# Altium project NEW_DC_motor_driver.PrjPcb
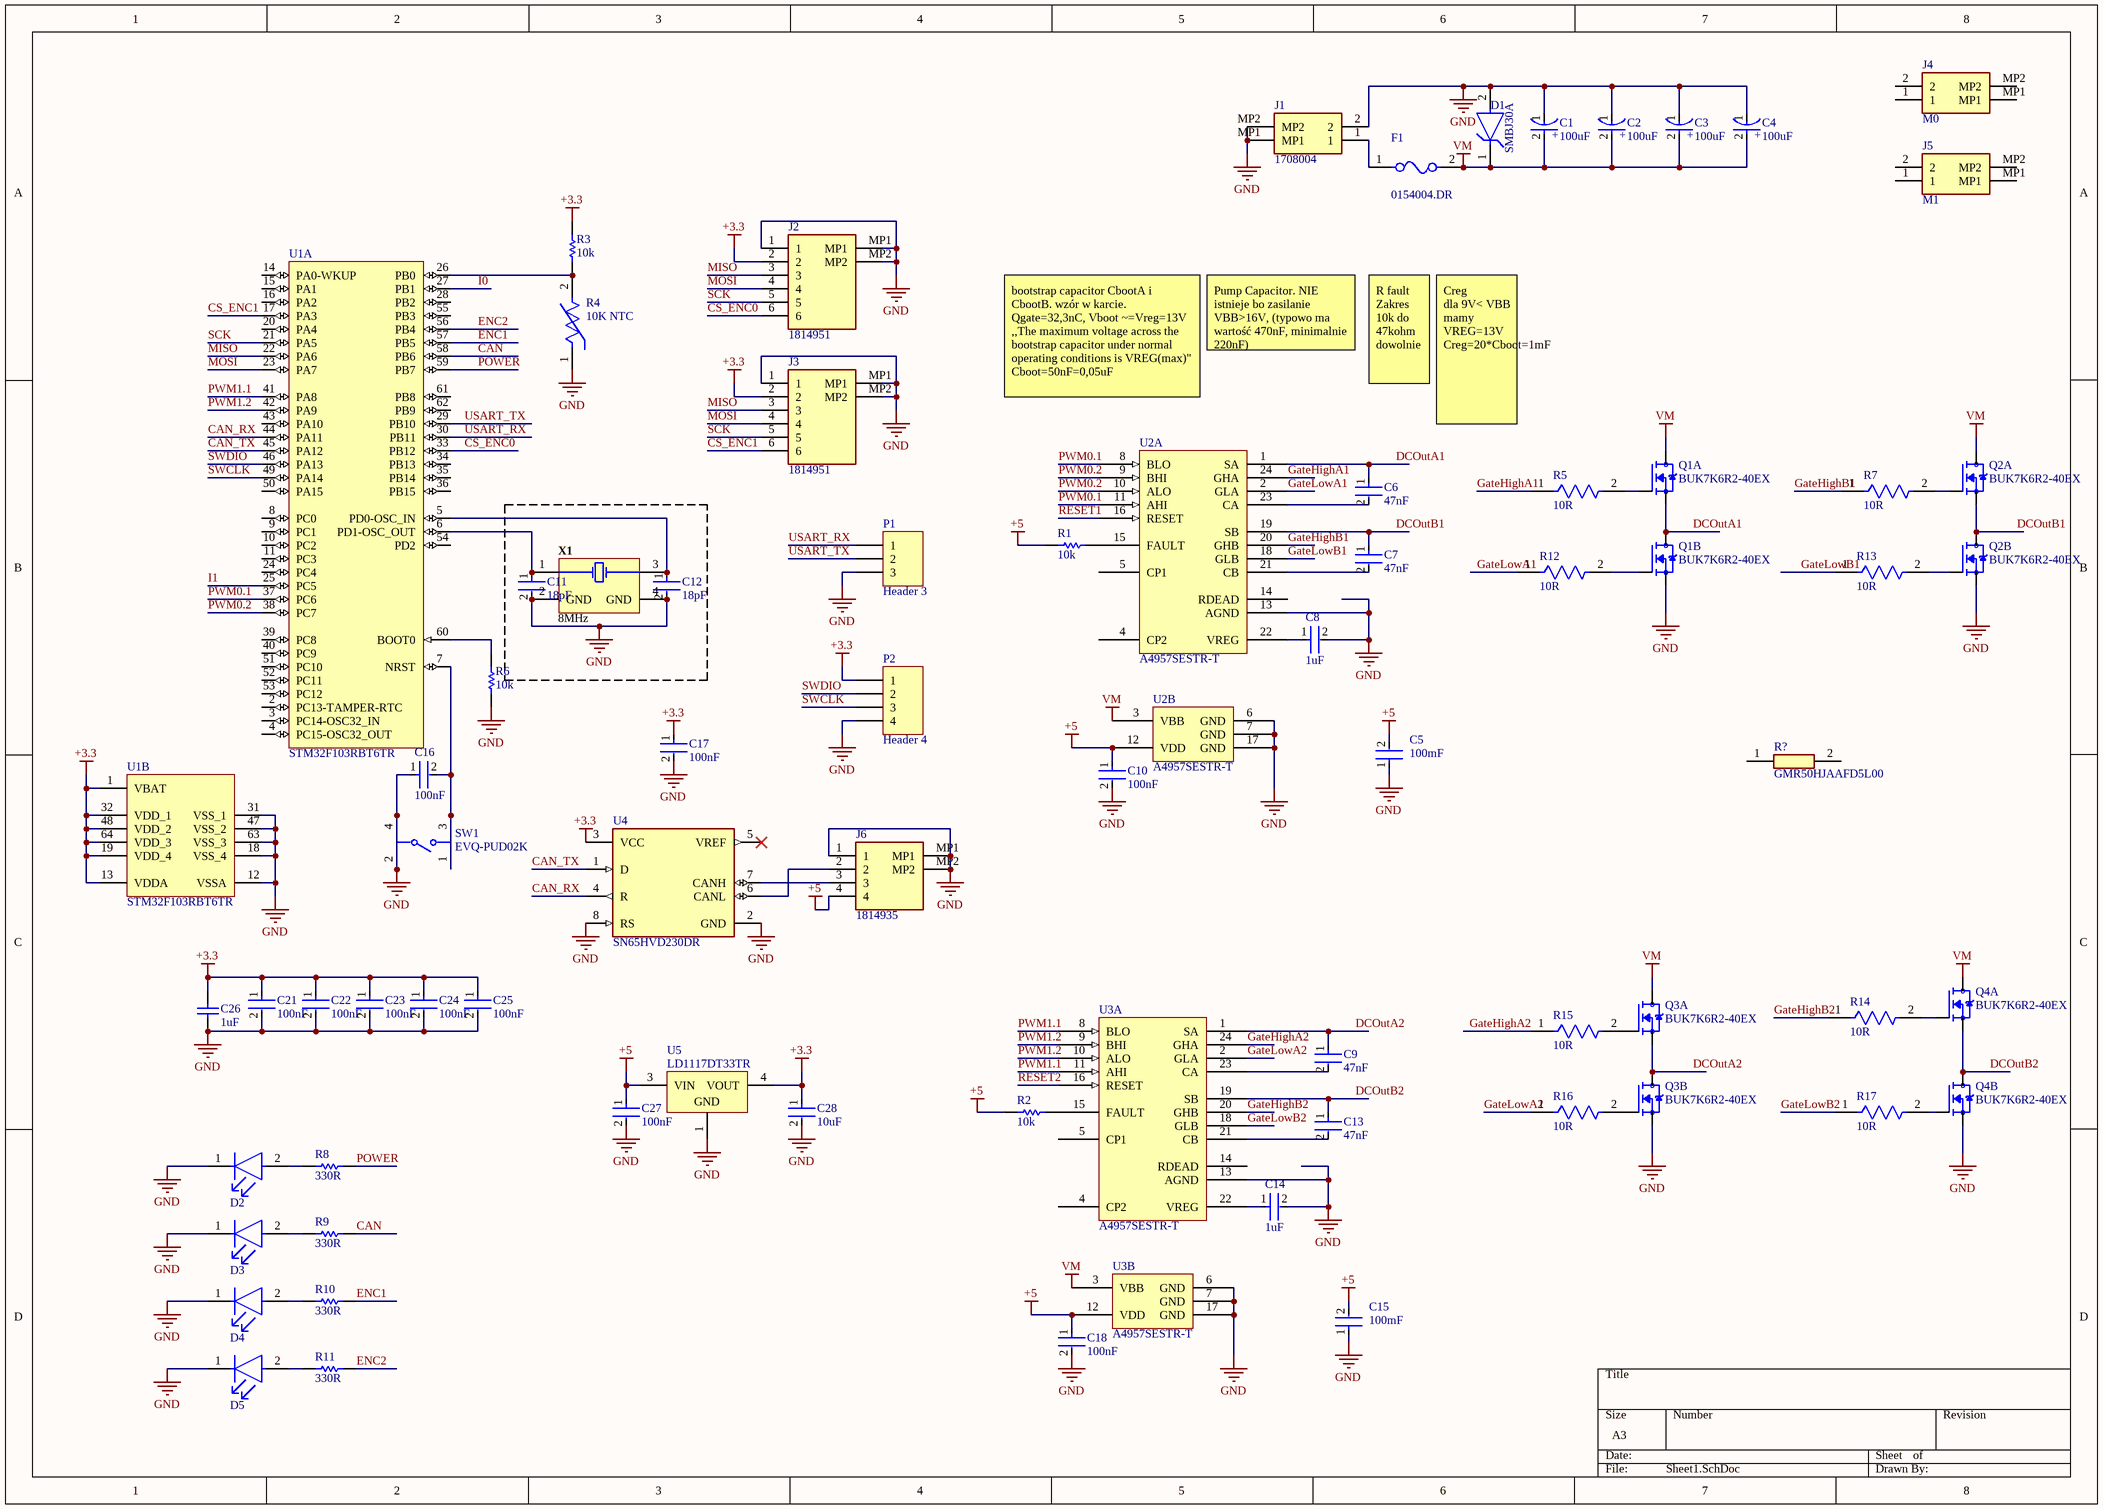
[diagram p0: Sheet1.SchDoc]
1 sheet, 69 parts. Net scope: global (net labels, ports and power ports of the same name join across sheets).
Board file: PCB1.PcbDoc

## Sheet Sheet1.SchDoc
size A3; Author: MG; CompanyName: SKAR; DrawnBy: MG; Revision: 1; SheetNumber: 1; SheetTotal: 1

### Parts
C1  100uF  [FP-FTD-MFG]
C2  100uF  [FP-FTD-MFG]
C3  100uF  [FP-FTD-MFG]
C4  100uF  [FP-FTD-MFG]
C5  100mF  [FP-0805-L_2_01_0_2-W_1_25-IPC_B]
C6  47nF  [FP-0805-L_2_01_0_2-W_1_25-IPC_B]
C7  47nF  [FP-0805-L_2_01_0_2-W_1_25-IPC_B]
C8  1uF  [FP-0805-L_2_01_0_2-W_1_25-MFG]
C9  47nF  [FP-0805-L_2_01_0_2-W_1_25-IPC_B]
C10  100nF  [FP-0805-L_2_01_0_2-W_1_25-IPC_B]
C11  18pF  [FP-C0603C-CF-MFG]
C12  18pF  [FP-C0603C-CF-MFG]
C13  47nF  [FP-0805-L_2_01_0_2-W_1_25-IPC_B]
C14  1uF  [FP-0805-L_2_01_0_2-W_1_25-MFG]
C15  100mF  [FP-0805-L_2_01_0_2-W_1_25-IPC_B]
C16  100nF  [FP-0805-L_2_01_0_2-W_1_25-IPC_B]
C17  100nF  [FP-0805-L_2_01_0_2-W_1_25-MFG]
C18  100nF  [FP-0805-L_2_01_0_2-W_1_25-IPC_B]
C21  100nF  [FP-0805-L_2_01_0_2-W_1_25-IPC_B]
C22  100nF  [FP-0805-L_2_01_0_2-W_1_25-IPC_B]
C23  100nF  [FP-0805-L_2_01_0_2-W_1_25-IPC_B]
C24  100nF  [FP-0805-L_2_01_0_2-W_1_25-IPC_B]
C25  100nF  [FP-0805-L_2_01_0_2-W_1_25-IPC_B]
C26  1uF  [CAPC2013X145X50ML20T25]
C27  100nF  [FP-0805-L_2_01_0_2-W_1_25-IPC_B]
C28  10uF  [FP-C0805C-DG-IPC_B]
D1  SMBJ30A  [FP-SMBJ30A-E3-52-0]
D2  TLLG4401  [FP-6_544-5255_01-4-MFG]  (value not drawn)
D3  TLLG4401  [FP-6_544-5255_01-4-MFG]  (value not drawn)
D4  TLLG4401  [FP-6_544-5255_01-4-MFG]  (value not drawn)
D5  TLLG4401  [FP-6_544-5255_01-4-MFG]  (value not drawn)
F1  0154004.DR  [FP-0154-MFG]
J1  1708004  [1708004]
J2  1814951  [1814951]
J3  1814951  [1814951]
J4  M0  [1815125]
J5  M1  [1815125]
J6  1814935  [1814935]
P1  Header 3  [HDR1X3]
P2  Header 4  [HDR1X4]
Q1  BUK7K6R2-40EX  [TRANS_BUK7K6R2-40EX]  (parts A,B of 2)
Q2  BUK7K6R2-40EX  [TRANS_BUK7K6R2-40EX]  (parts A,B of 2)
Q3  BUK7K6R2-40EX  [TRANS_BUK7K6R2-40EX]  (parts A,B of 2)
Q4  BUK7K6R2-40EX  [TRANS_BUK7K6R2-40EX]  (parts A,B of 2)
R1  10k  [RESC2013X60X35NL10T20]
R2  10k  [RESC2013X60X35NL10T20]
R3  10k  [RESC2013X60X35ML10T20]
R4  10K NTC  [FP-NCP18-0_15-IPC_A]
R5  10R  [FP-RR1220-IPC_A]
R6  10k  [RESC2013X60X35ML10T20]
R7  10R  [FP-RR1220-IPC_A]
R8  330R  [RESC2013X60X35ML10T20]
R9  330R  [RESC2013X60X35ML10T20]
R10  330R  [RESC2013X60X35ML10T20]
R11  330R  [RESC2013X60X35ML10T20]
R12  10R  [FP-RR1220-IPC_A]
R13  10R  [FP-RR1220-IPC_A]
R14  10R  [FP-RR1220-IPC_A]
R15  10R  [FP-RR1220-IPC_A]
R16  10R  [FP-RR1220-IPC_A]
R17  10R  [FP-RR1220-IPC_A]
R?  GMR50HJAAFD5L00  [GMR50HJAAFD5L00]
SW1  EVQ-PUD02K  [FP-EVQ-PUD02K-MFG]
U1  STM32F103RBT6TR  [STM-LQFP64_V]  (parts A,B of 2)
U2  A4957SESTR-T  [QFN50P400X400X80_HS-25M(A4957SESTR-T)]  (parts A,B of 2)
U3  A4957SESTR-T  [QFN50P400X400X80_HS-25M(A4957SESTR-T)]  (parts A,B of 2)
U4  SN65HVD230DR  [FP-D0008A-IPC_A]
U5  LD1117DT33TR  [TO-252_M]
X1  8MHz  [TXC-7B-4_V]

### Nets
+3.3: C17.1 C21.1 C22.1 C23.1 C24.1 C25.1 C26.2 C28.1 J2.2 J3.2 P2.1 R3.2 U1.1(VBAT) U1.13(VDDA) U1.19(VDD_4) U1.32(VDD_1) U1.48(VDD_2) U1.64(VDD_3) U4.3(VCC) U5.4(VOUT)
+5: C5.2 C10.1 C15.2 C18.1 C27.1 J6.4 R1.1 R2.1 U2.12(VDD) U3.12(VDD) U5.3(VIN)
GND: C1.1(C) C2.1(C) C3.1(C) C4.1(C) C5.1 C8.2 C10.2 C11.2 C12.2 C14.2 C15.1 C16.1 C17.2 C18.2 C21.2 C22.2 C23.2 C24.2 C25.2 C26.1 C27.2 C28.2 D1.2(A) D2.1(C) D3.1(C) D4.1(C) D5.1(C) J1.2 J1.MP1 J1.MP2 J2.1 J2.MP1 J2.MP2 J3.1 J3.MP1 J3.MP2 J6.1 J6.MP1 J6.MP2 P1.3 P2.4 Q1.3(S2) Q2.3(S2) Q3.3(S2) Q4.3(S2) R4.1 R6.1 SW1.2 SW1.4 U1.12(VSSA) U1.18(VSS_4) U1.31(VSS_1) U1.47(VSS_2) U1.63(VSS_3) U2.6(GND) U2.7(GND) U2.13(AGND) U2.17(GND) U3.6(GND) U3.7(GND) U3.13(AGND) U3.17(GND) U4.2(GND) U4.8(RS) U5.1(GND) X1.2(GND) X1.4(GND)
VM: C1.2(A) C2.2(A) C3.2(A) C4.2(A) D1.1(C) F1.2 Q1.7_8(D1) Q2.7_8(D1) Q3.7_8(D1) Q4.7_8(D1) U2.3(VBB) U3.3(VBB)
CAN: R9.1 U1.58(PB6)
CAN_RX: U1.44(PA11) U4.4(R)
CAN_TX: U1.45(PA12) U4.1(D)
CS_ENC0: J2.6 U1.33(PB12)
CS_ENC1: J3.6 U1.17(PA3)
DCOutA1: C6.1 Q1.1(S1) Q1.5_6(D2) U2.1(SA)
DCOutA2: C9.1 Q3.1(S1) Q3.5_6(D2) U3.1(SA)
DCOutB1: C7.1 Q2.1(S1) Q2.5_6(D2) U2.19(SB)
DCOutB2: C13.1 Q4.1(S1) Q4.5_6(D2) U3.19(SB)
ENC1: R10.1 U1.57(PB5)
ENC2: R11.1 U1.56(PB4)
GateHighA1: R5.1 U2.24(GHA)
GateHighA2: R15.1 U3.24(GHA)
GateHighB1: R7.1 U2.20(GHB)
GateHighB2: R14.1 U3.20(GHB)
GateLowA1: R12.1 U2.2(GLA)
GateLowA2: R16.1 U3.2(GLA)
GateLowB1: R13.1 U2.18(GLB)
GateLowB2: R17.1 U3.18(GLB)
I0: U1.27(PB1)
I1: U1.25(PC5)
MISO: J2.3 J3.3 U1.22(PA6)
MOSI: J2.4 J3.4 U1.23(PA7)
POWER: R8.1 U1.59(PB7)
PWM0.1: U1.37(PC6) U2.8(BLO) U2.11(AHI)
PWM0.2: U1.38(PC7) U2.9(BHI) U2.10(ALO)
PWM1.1: U1.41(PA8) U3.8(BLO) U3.11(AHI)
PWM1.2: U1.42(PA9) U3.9(BHI) U3.10(ALO)
RESET1: U2.16(RESET)
RESET2: U3.16(RESET)
SCK: J2.5 J3.5 U1.21(PA5)
SWCLK: P2.3 U1.49(PA14)
SWDIO: P2.2 U1.46(PA13)
USART_RX: P1.1 U1.30(PB11)
USART_TX: P1.2 U1.29(PB10)
NetC6_2: C6.2 U2.23(CA)
NetC7_2: C7.2 U2.21(CB)
NetC8_1: C8.1 U2.22(VREG)
NetC9_2: C9.2 U3.23(CA)
NetC11_1: C11.1 U1.6(PD1-OSC_OUT) X1.1(X1)
NetC12_1: C12.1 U1.5(PD0-OSC_IN) X1.3(X2)
NetC13_2: C13.2 U3.21(CB)
NetC14_1: C14.1 U3.22(VREG)
NetC16_2: C16.2 SW1.1 SW1.3 U1.7(NRST)
NetD2_2: D2.2(A) R8.2
NetD3_2: D3.2(A) R9.2
NetD4_2: D4.2(A) R10.2
NetD5_2: D5.2(A) R11.2
NetF1_1: F1.1 J1.1
NetJ6_2: J6.2 U4.6(CANL)
NetJ6_3: J6.3 U4.7(CANH)
NetQ1_2: Q1.2(G1) R5.2
NetQ1_4: Q1.4(G2) R12.2
NetQ2_2: Q2.2(G1) R7.2
NetQ2_4: Q2.4(G2) R13.2
NetQ3_2: Q3.2(G1) R15.2
NetQ3_4: Q3.4(G2) R16.2
NetQ4_2: Q4.2(G1) R14.2
NetQ4_4: Q4.4(G2) R17.2
NetR1_2: R1.2 U2.15(FAULT)
NetR2_2: R2.2 U3.15(FAULT)
NetR3_1: R3.1 R4.2 U1.26(PB0)
NetR6_2: R6.2 U1.60(BOOT0)

Not connected (* = marked no-connect by the designer): J4 1 2 MP1 MP2; J5 1 2 MP1 MP2; R? 1 2; U1 2(PC13-TAMPER-RTC) 3(PC14-OSC32_IN) 4(PC15-OSC32_OUT) 8(PC0) 9(PC1) 10(PC2) 11(PC3) 14(PA0-WKUP) 15(PA1) 16(PA2) 20(PA4) 24(PC4) 28(PB2) 34(PB13) 35(PB14) 36(PB15) 39(PC8) 40(PC9) 43(PA10) 50(PA15) 51(PC10) 52(PC11) 53(PC12) 54(PD2) 55(PB3) 61(PB8) 62(PB9); U2 4(CP2) 5(CP1) 14(RDEAD); U3 4(CP2) 5(CP1) 14(RDEAD); U4 5(VREF)*

### Notes on the sheet
- Pump Capacitor. NIE istnieje bo zasilanie VBB>16V, (typowo ma wartość 470nF, minimalnie 220nF)
- R fault                                                                                    Zakres 10k do 47kohm dowolnie
- bootstrap capacitor CbootA i CbootB. wzór w karcie. Qgate=32,3nC, Vboot ~=Vreg=13V             ,,The maximum voltage across the bootstrap capacitor under normal operating conditions is VREG(max)"                            Cboot=50nF=0,05uF
- Creg
  dla 9V< VBB mamy VREG=13V Creg=20*Cboot=1mF
- (in symbol CMP-05427-000027-1) +

### Library data of the parts
C1-C4 = CMP-05427-000027-1: CAP ALUM 100UF 20% 35V SMD; Ripple Current: 300mA; Polarity: Polar; Life (Hours): 2000Hour; Lead Diameter: 0.65mm; ESR (Equivalent Series Resistance): 260mR; Leakage Current: 35uA; REACH SVHC: No SVHC; Series: FT; Min Operating Temperature: -55°C; Diameter: 6.3mm; Max Operating Temperature: 105°C; Number of Pins: 2; Package Quantity: 1000; Length: 5.8mm; Lead Pitch: 1.8mm; Voltage: 35V; Construction: Cylindrical; Capacitance: 100uF; Height: 5.8mm; Tolerance: 20%; RoHS Compliant: Yes; Packaging: Tape and Reel; Ripple Current (AC): 300mA; Height - Seated (Max): 0.24inch; Voltage Rating: 35V; Radiation Hardening: No; Contact Plating: Tin; Termination: SMD/SMT; Voltage Rating (DC): 35V; Case/Package: Radial; Mount: Surface Mount
C5 C10 C15-C18 C21-C25 C27 = CMP-2007-04174-2: General Purpose Ceramic Capacitor, 0805, 100nF, 10%, X7R, 15%, 100V; Packaging: Tape and Reel; Min Operating Temperature: -55°C; Dielectric Material: Ceramic; Height: 1.4mm; Voltage Rating: 100V; Termination: SMD/SMT; Case Code (Imperial): 0805; Case Code (Metric): 2012; Case/Package: 0805; Construction: Flat; Radiation Hardening: No; Series: -; Dielectric: X7R; Package Quantity: 2000; Mount: Surface Mount; Capacitance: 100nF; Contact Plating: Tin; Voltage: 100V; Lead Free: Lead Free; Depth: 1.25mm; RoHS Compliant: Yes; Number of Pins: 2; Max Operating Temperature: 125°C; Length: 2.01mm; Voltage Rating (DC): 100V; Thickness: 0.055inch; REACH SVHC: No SVHC; Width: 0.049inch; Tolerance: 10%
C6 C7 C9 C13 = CMP-2007-04794-2: General Purpose Ceramic Capacitor, 0805, 47nF, 10%, X8R, 15%, 50V; Packaging: Cut Tape; Case/Package: 0805; Length: 2.01mm; Voltage Rating (DC): 50V; Voltage: 50V; Voltage Rating: 50V; Case Code (Imperial): 0805; Case Code (Metric): 2012; Number of Pins: 2; Termination: SMD/SMT; Max Operating Temperature: 150°C; Capacitance: 47nF; Min Operating Temperature: -55°C; Dielectric Material: Ceramic; Series: Standard; Dielectric: X8R; REACH SVHC: No SVHC; Mount: Surface Mount; Depth: 1.25mm; RoHS Compliant: Yes; Height: 0.94mm; Tolerance: 10%
C8 C14 = CMP-2007-04692-2: General Purpose Ceramic Capacitor, 0805, 1uF, 10%, X7R, 15%, 25V; Max Operating Temperature: 125°C; Contact Plating: Tin; Tolerance: 10%; Dielectric: X7R; Case/Package: 0805; Package Quantity: 3000; Width: 0.049inch; Voltage Rating: 25V; Capacitance: 1uF; Lead Free: Lead Free; REACH SVHC: No SVHC; RoHS Compliant: Yes; Case Code (Imperial): 0805; Packaging: Tape and Reel; Dielectric Material: Ceramic; Series: -; Construction: Flat; Termination: SMD/SMT; Radiation Hardening: No; Voltage: 25V; Height: 1.4mm; Number of Pins: 2; Mount: Surface Mount; Length: 2.01mm; Depth: 1.25mm; Voltage Rating (DC): 25V; Min Operating Temperature: -55°C; Thickness: 0.037inch; Case Code (Metric): 2012
C11 C12 = CMP-2006-03103-2: CAP CER 18PF 100V 5% NP0 0603; Manufacturer: KEMET; Manufacturer Part Number: C0603C180J1GACTU; Automotive Grade: Grade 1; Temperature Characteristic: C0G; Material: Ceramic; Tolerance: 0.05; Temperature Coefficient: 30ppm/°C; Temperature Range High: +125°C; RoHS: TRUE; Lead Free: Yes; Device Class L1: Passive Components; Mouser Description: Multilayer Ceramic Capacitors MLCC - SMD/SMT 100volts 18pF C0G 5%; Automotive: Yes; Category: Cap; Temperature Range Low: -55°C; Package: C0603C-CF; Digikey Description: CAP CER 18PF 100V 5% NP0 0603; Voltage Rating: 100 V; Value: 18 pF; Device Class L3: Ceramic Capacitors; Temperature: -55°C to +125°C; Capacitance: 18 pF; Octopart: https://octopart.com/c0603c180j1gactu-kemet-9138579; Height: 0.87mm; ComponentLink2URL: https://api.kemet.com/component-edge/download/datasheet/C0603C100J5GACAUTO.pdf; ComponentLink2Description: Datasheet; Device Class L2: Capacitors
C26 = CMP-1036-04746-2: Manufacturer: Kemet; Part Number: C0805C105K4PACTU
C28 = CMP-2007-03243-2: CAP CER 10UF 10V X5R 0805; Manufacturer Part Number: C0805C106K8PACTU; Manufacturer: Kemet; 3DS Part Number: 220-00001; Tolerance: 10%; Temperature Coefficient: 15%; Material: Ceramic; Device Class L2: Capacitors; Device Class L1: Passive Components; ComponentLink2URL: https://content.kemet.com/datasheets/KEM_C1006_X5R_SMD.pdf; Height: 1.4mm; Lead Free: Yes; Digikey Description: CAP CER 10UF 10V X5R 0805; Octopart: https://octopart.com/c0805c106k8pactu-kemet-98697; Capacitance: 10uF; Value: 10uF; Temperature Range Low: -55°C; Temperature: -55°C to +85°C; Automotive: No; Mouser Description: CAP CER 10UF 10V X5R 0805; Ipc Land Pattern Name: CAPC200125X125; Temperature Range High: +85°C; Voltage: 10V; RoHS: TRUE; Device Class L3: Ceramic Capacitors; ComponentLink2Description: Datasheet; Voltage Rating: 10V; Package: C0805C-DG; Temperature Characteristic: X5R; Category: Cap
D1 = CMP-02577-000026-1: TVS DIODE 30VWM 48.4VC DO214AA; Polarity: Unidirectional; Clamping Voltage: 48.4V; Element Configuration: Single; Leakage Current: 1uA; Min Breakdown Voltage: 33.3V; Peak Pulse Power: 600W; Max Breakdown Voltage: 36.8V; Test Current: 1mA; Max Surge Current: 12.4A; Number of Unidirectional Channels: 1; Power Line Protection: No; Diode Type: ZENER; Operating Supply Voltage: 30V; Max Operating Temperature: 150°C; Number of Pins: 2; Series: TransZorb®; Min Operating Temperature: -55°C; Package Quantity: 750; Mount: Surface Mount; Resistor Type: Zener; Clamping Voltage-Max: 48.4V; Packaging: Tape and Reel; Length: 4.57mm; Direction: Unidirectional; Termination: SMD/SMT; Reverse Breakdown Voltage: 33.3V; Peak Pulse Current: 12.4A; Lead Free: Lead Free; Height: 2.24mm; RoHS Compliant: Yes; Breakdown Voltage: 36.8V; Max Power Dissipation: 600W; Power Dissipation: 600W; Max Reverse Leakage Current: 1uA; Reverse Standoff Voltage: 30V; Number of Channels: 1; Case/Package: DO-214AA; Width: 3.94mm; Number of Elements: 1; Radiation Hardening: No
D2-D5 = CMP-00030-39390728-1: TLLG4401 LED, Green, 2mcd, 3mmDia., T-1, +/-25deg, 565nm, 7mA, 1.9V Vf, 20V Vr, 20mW, -40; Test Current: 2mA; Wavelength: 575nm; Number of Elements: 1; Viewing Angle: 25°; Lens Transparency: Diffused; Voltage Rating (DC): 2.4V; Lead Length: 23mm; Max Junction Temperature (Tj): 100°C; Lens Style: Circular, Colored, Diffused, Dome, Round, Tinted; Reverse Voltage: 6V; Forward Voltage: 1.9V; Length: 3.2mm; Forward Current: 2mA; Color: Green; Dominant Wavelength: 575nm; Radiation Hardening: No; NexarPartId: 39390728; Lens Color: Green; REACH SVHC: Unknown; Lead Free: Lead Free; Number of Pins: 2; Luminous Intensity: 2mcd; Schedule B: 8541402000, 8541402000; Max Operating Temperature: 100°C; Illumination Color: Green; Mount: Through Hole; Packaging: Bulk; Depth: 3.2mm; Ambient Temperature Range High: 100°C; Case/Package: Radial; Power Dissipation: 20mW; Height: 4.5mm; RoHS: Compliant; Peak Wavelength: 565nm; Min Operating Temperature: -40°C; Number of LEDs: 1
F1 = CMP-08605-000003-1: FUSE BRD MNT 4A 125VAC/VDC 2SMD; Manufacturer: Littelfuse; Fuse Blow Speed: Fast; Max Fuse Ac Voltage: 125V; Lead Free: Yes; Device Class L3: unset; Manufacturer Part Number: 0154004.DR; Device Class L2: Fuses; Package: 0154; ComponentLink2Description: Datasheet; Temperature Range Low: -55°C; Temperature Range High: +125°C; Device Class L1: Circuit Protection; Height: 3.81mm; Temperature: -55°C to +125°C; Mouser Description: Surface Mount Fuses Fuseblock w/ fuse 4A OMNI BLOK 154; Automotive: No; Digikey Description: FUSE BRD MNT 4A 125VAC/VDC 2SMD; RoHS: TRUE; Category: Fuse; Fuse Current: 4A; Max Fuse Dc Voltage: 125V; ComponentLink2URL: https://www.littelfuse.com/~/media/electronics/datasheets/fuses/littelfuse_fuse_154_154t_154l_154tl_datasheet.pdf.pdf; Octopart: https://octopart.com/0154004.dr-littelfuse-565861
J1 = 1708004: Pluggable Terminal Blocks PTSM 0,5/ 2-HH- 2,5-SMD WH R32; Manufacturer_Name: Phoenix Contact; Geometry.Height: 5.1mm; Mouser Part Number: 651-1708004; Mouser Price/Stock: https://www.mouser.co.uk/ProductDetail/Phoenix-Contact/1708004?qs=lk7NfA15ZfaUlLrlGV0nCA%3D%3D; Manufacturer_Part_Number: 1708004; Datasheet Link: http://www.phoenixcontact.net/product/1708004
J2 J3 = 1814951: Pluggable Terminal Blocks PTSM 0,5/ 6-HH0-2,5- SMD WH R44
J4 J5 = 1815125: Phoenix Contact PTSM Series, 2.5mm Pitch Printed Circuit Board Connector, 6A; Geometry.Height: 5mm; Mouser Part Number: 651-1815125; Mouser Price/Stock: https://www.mouser.com/Search/Refine.aspx?Keyword=651-1815125; Manufacturer_Name: Phoenix Contact; Manufacturer_Part_Number: 1815125; Datasheet Link: https://www.phoenixcontact.com/online/portal/ca/?uri=pxc-oc-itemdetail:pid=1815125&library=caen&pcck=P-11-02-11&tab=1&selectedCategory=ALL
J6 = 1814935: Pluggable Terminal Blocks PTSM 0,5/ 4-HH0-2,5- SMD WH R32
P1 = Header 3: Header, 3-Pin; LatestRevisionDate: 17-Jul-2002; LatestRevisionNote: Re-released for DXP Platform.; Publisher: Altium Limited
P2 = Header 4: Header, 4-Pin; LatestRevisionDate: 17-Jul-2002; LatestRevisionNote: Re-released for DXP Platform.; Publisher: Altium Limited
Q1-Q4 = BUK7K6R2-40EX: Mosfet Array 2 N-Channel (Dual) 40V 40A 68W Surface Mount LFPAK56D; MF: Nexperia; Package: LFPAK56D-8 Nexperia USA Inc.; Price: None; Check_prices: https://www.snapeda.com/parts/BUK7K6R2-40EX/Nexperia/view-part/?ref=eda; Value: *; SnapEDA_Link: https://www.snapeda.com/parts/BUK7K6R2-40EX/Nexperia/view-part/?ref=snap; MP: BUK7K6R2-40EX; Availability: In Stock; Purchase-URL: https://pricing.snapeda.com/search/part/BUK7K6R2-40EX/?ref=eda
R1 R2 = CMP-1659-00013-4: Chip Resistor, 10 KOhm, +/- 1%, 0.125 W, -55 to 155 degC, 0805 (2012 Metric), RoHS, Tape and Reel; Manufacturer: Yageo; Voltage Rating: 150 V; Mount: Surface Mount; ComponentLink1Description: Manufacturer URL; ComponentLink2URL: http://www.yageo.com/documents/recent/PYu-RC_Group_51_RoHS_L_04.pdf; Pins: 2; Length: 2 mm; Min Operating Temperature: -55 degC; Height: 0.5 mm; Mounting Technology: Surface Mount; RoHSCompliant: true; REACH SVHC: No SVHC; ComponentLink1URL: http://www.yageo.com/; Max Operating Temperature: 155 degC; PackageReference: 0805; DatasheetVersion: Rev. 4, 02/2016; Package Quantity: 5000; Packaging: Tape and Reel; ComponentLink2Description: Datasheet; PackageDescription: 2-Pin Surface Mounted Device, Body 2 x 1.25 mm
R3 R6 = CMP-2100-03673-1: Chip Resistor, 0 Ohm, Jumper, +/- 5%, 0.125 W, -55 to 155 degC, 0805 (2012 Metric), RoHS, Tape and Reel; Manufacturer: Yageo; Power Rating: 125mW; Resistance: 0mOhm; Voltage Rating (DC): 150V; Temperature Coefficient: 200ppm/degreesC; Height: 0.5mm; Depth: 1.25mm; Case Code (Imperial): 0805; Lead Free: LeadFree; Military Standard: Not; Package Description: 2-Pin Surface Mounted Device, Body 2 x 1.25 mm; Case Code (Metric): 2012; Composition: ThickFilm; Voltage Rating: 150V; Manufacturer URL: http://www.yageo.com/; Packaging: TapeandReel; Package Reference: 0805; REACH SVHC: Unknown; Tolerance: 5%; Case/Package: 0805; Max Operating Temperature: 155degC; Number of Pins: 2; Min Operating Temperature: -55degC; RoHSCompliant: true; Length: 2mm; Datasheet URL: http://www.yageo.com/NewPortal/yageodocoutput?fileName=/pdf/R-Chip/PYu-RC_Group_51_RoHS_L_5.pdf; Termination: SMD/SMT; Radiation Hardening: No; Width: 1.25mm; Contact Plating: Tin; Datasheet Version: Rev. 5, 10/2016
R4 = CMP-2000-05271-3: NTC Thermistor for Temperature Sensor, 0603, 10kΩ, 1%, 0.1mA, 5V; Manufacturer Series: NCP18; Accuracy: 0.7%; Current Rating: 310uA; Max Power Dissipation: 100mW; Thermistor Application: TEMPERATURE COMPENSATION; Number of Terminals/Pins: 2; Resistance: 10kR; Case Code (Metric): 1608; RoHS Compliant: Yes; Max Operating Temperature: 125°C; Resistance Tolerance: 1%; Case/Package: 0603; Mount: Surface Mount; Lead Free: Lead Free; Min Operating Temperature: -40°C; REACH SVHC: No SVHC; Package Shape: Rectangular; Radiation Hardening: No; Series: NCP; Depth: 0.8mm; Number of Pins: 2; Length: 1.6mm; Height: 0.8mm; Terminal Placement: Dual; Tolerance: 1%; Case Code (Imperial): 0603; Terminal Finish: Tin; Power Rating: 100mW; Termination: SMD/SMT; Packaging: Tape and Reel; Package Quantity: 1
R5 R7 R12-R17 = CMP-2001-03540-2: 10Ω ±0.5% 0.1W 1/10W Chip Resistor 0805 (2012 Metric) Thin Film; Working Voltage: 100V; Max Power Dissipation: 100mW; Temperature Coefficient: 50ppm/°C; Resistance Tolerance: 0.5%; RoHS Compliant: Yes; Min Operating Temperature: -55°C; Case Code (Metric): 2012; Termination: SMD/SMT; Number of Terminations: 2; Length: 2mm; Package Quantity: 5000; Case Code (Imperial): 0805; Power Rating: 100mW; Case/Package: 0805; Resistor Type: Thin Film; Weight: 0.000194oz; Resistance: 10R; Voltage Rating (DC): 100V; Depth: 1.25mm; Packaging: Tape and Reel; Max Operating Temperature: 125°C; Tolerance: 0.5%; Width: 0.049inch; Series: RR; Voltage Rating: 100V; Technology: THIN FILM; Number of Pins: 2; Lead Free: Lead Free; Height: 0.4mm
R8-R11 = CMP-2100-03671-1: Chip Resistor, 1 KOhm, +/- 1%, 125 mW, -55 to 155 degC, 0805 (2012 Metric), RoHS, Tape and Reel; Manufacturer: Yageo; Temperature Coefficient: 100ppm/degreesC; Voltage Rating (DC): 150V; Max Power Dissipation: 125mW; Resistance: 1KOhm; Number of Pins: 2; Number of Terminations: 2; Datasheet URL: http://www.yageo.com/NewPortal/yageodocoutput?fileName=/pdf/R-Chip/PYu-RC_Group_51_RoHS_L_5.pdf; Length: 0.079inch; Package Description: 2-Pin Surface Mounted Device, Body 2 x 1.25 mm; Depth: 1.25mm; Height: 0.024inch; Military Standard: Not; Case/Package: 0805; Package Reference: 0805; RoHSCompliant: true; Lead Free: LeadFree; Packaging: TapeandReel; Package Quantity: 1; Datasheet Version: Rev. 5, 10/2016; Tolerance: 1%; Min Operating Temperature: -55degC; Voltage Rating: 150V; Composition: ThickFilm; Case Code (Imperial): 0805; Power Rating: 125mW; Width: 0.049inch; Case Code (Metric): 2012; Manufacturer URL: http://www.yageo.com/; Max Operating Temperature: 155degC; REACH SVHC: Unknown; Termination: SMD/SMT
R? = GMR50HJAAFD5L00: Current Sense Resistors - SMD High Power Low Ohmic Chip Shunt 5 mOhms; Manufacturer_Name: ROHM Semiconductor; Datasheet Link: https://datasheet.datasheetarchive.com/originals/distributors/Datasheets_SAMA/8766f7ead908a4aa36cac8ef683cf740.pdf; Height: 0.55mm; Manufacturer_Part_Number: GMR50HJAAFD5L00; Mouser Part Number: 755-GMR50HJAAFD5L00; Mouser Price/Stock: https://www.mouser.co.uk/ProductDetail/ROHM-Semiconductor/GMR50HJAAFD5L00?qs=GBLSl2Akirvaz25S3G4Wxw%3D%3D
SW1 = CMP-05618-000144-1: SWITCH TACTILE SPST-NO 0.05A 12V; Current Rating: 50mA; Operating Force: 2.2N; Contact Resistance: 500mR; Switch Travel: 0.3mm; Actuator Length: 1mm; Illumination Type: Non-Illuminated; Electrical Life: 100000Cycles; Actuator Color: Black; Switch Function: Off-Mom; Throw Configuration: SPST; Radiation Hardening: No; Min Operating Temperature: -20°C; Length: 4.7mm; Size: 3.5mm; Package Quantity: 1; RoHS Compliant: Yes; Width: 3.5mm; Max Operating Temperature: 70°C; Max Voltage Rating (DC): 12V; Max Current Rating: 50mA; Height: 1.65mm; Depth: 4.5mm; Voltage Rating (DC): 12V; Mount: Surface Mount; Lead Free: Lead Free; Termination: J-Bend; Series: EVQPU; Contact Current Rating: 50mA; Orientation: Right Angle; REACH SVHC: No SVHC; Packaging: Tape and Reel; Contact Plating: Gold; Mechanical Life: 100000Cycles
U1 = CMP-0237-00169-4: ARM Cortex-M3 32-bit MCU, 128 KB Flash, 20 KB Internal RAM, 51 I/Os, 64-pin LQFP, -40 to 85 degC, Tape and Reel; Operating Frequency(F) (Processor speed) (MHz): 72; Internal RAM Size (kB): 20; I/Os (High Current): 51; FLASH Size (Prog) (kB): 128; Supply Voltage(Vcc) min (V): 2; A/D Converter: 2x12-bit (16 Channel); ComponentLink3URL: http://www.st.com/st-web-ui/static/active/en/resource/technical/document/datasheet/DM00037051.pdf; ComponentLink2Description: Datasheet; PackageDescription: 64-Pin Low Profile Quad Flat Package, 10 x 10 mm Body, 0.5 mm Pitch; ComponentLink3Description: Package Specification; Mounting Technology: Surface Mount; ComponentLink1Description: Manufacturer URL; DatasheetVersion: Rev. 16; PackageReference: LQFP64; PartNumber: STM32F103RBT6TR; Core: ARM Cortex-M3; ComponentLink2URL: http://www.st.com/st-web-ui/static/active/en/resource/technical/document/datasheet/CD00161566.pdf; ComponentLink1URL: http://www.st.com/web/en/home.html; PackageVersion: Rev. 4, 06/2013; Packing: Tape and Reel
U4 = CMP-0315-00015-3: IC TRANSCEIVER HALF 1/1 8SOIC; Number of Transceivers: 1; Operating Supply Voltage: 3.3V; Number of I/Os: 2; Max Supply Current: 17mA; Max Supply Voltage: 3.6V; Min Supply Voltage: 3V; Data Rate: 1Mbps; Min Operating Temperature: -40°C; Packaging: Tape and Reel; Lead Free: Lead Free; Number of Transmit Buffers: 1; Max Operating Temperature: 85°C; Number of Receive Buffers: 1; Number of Pins: 8; Package Quantity: 1; Radiation Hardening: No; Case/Package: D; REACH SVHC: No SVHC; Weight: 0.002561oz; Termination: SMD/SMT; Contact Plating: Gold; Nominal Supply Current: 17mA; Number of Receivers: 1; Number of Drivers: 1
U5 = CMP-0244-00088-1: Fixed Low Drop Positive Voltage Regulator, 3.3V, 3-Pin DPAK, Tape and Reel; ComponentLink1Description: Manufacturer URL; PackageVersion: 2011; PackageReference: TO-252; ComponentLink2Description: Datasheet; ComponentLink1URL: http://www.st.com; DatasheetVersion: 1/11/2011; PackageDescription: 3-Pin Transistor Outline Package 2.28 mm Pitch, 9.7 mm Lead Span (DPAK); ComponentLink2URL: http://www.st.com/internet/com/TECHNICAL_RESOURCES/TECHNICAL_LITERATURE/DATASHEET/CD00000544.pdf
X1 = CMP-1774-00004-1: SMD Seam Sealing Crystal, 8 MHz, +/- 30 ppm, 18 pF, -10 to 70 degC, 4-Pin SMD, RoHS, Tape and Reel; Power Rating: 100 mW; Case\Package: 0603; Voltage Rating: 50 V; Tolerance: 1%; Resistance: 150 Ohm; Package Quantity: 5000; Case Code (Metric): 1608; Packaging: Tape and Reel; Length: 1.6 mm; RoHSCompliant: true; REACH SVHC: No SVHC; Mount: Surface Mount; Case Code (Imperial): 0603; Pins: 2; Width: 0.8 mm; PackageDescription: 4-Pin Surface Mount Device, Body 5 x 3.2 mm, Pitch 3.7 mm; ComponentLink1Description: Datasheet; DatasheetVersion: Jul-15; ComponentLink1URL: http://www.txccorp.com/download/products/quartz_crystals/2015TXC_7B_19.pdf; PackageReference: 7B-4; Height: 0.45 mm; Max Operating Temperature: 155 degC; Min Operating Temperature: -55 degC; Voltage Rating (DC): 50 V